# Altium schematic sheet Schematic sheet.SchDoc
size A4
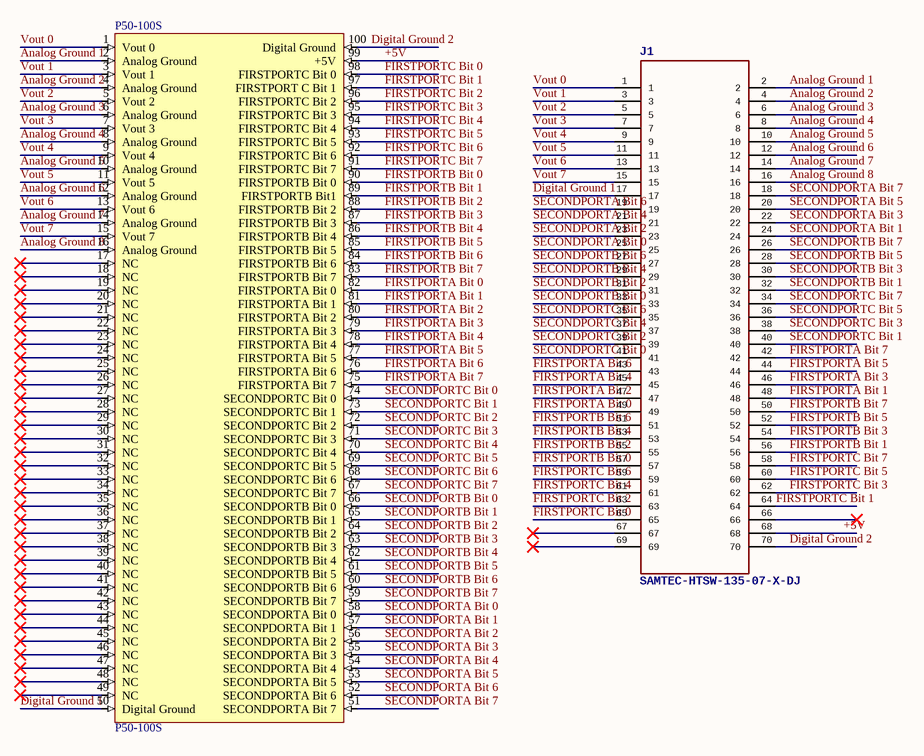
[diagram p0: Schematic sheet.SchDoc]

## Parts
J1  SAMTEC-HTSW-135-07-X-DJ  [SAMTEC-HTSW-135-07-X-D]
P50-100S  P50-100S  [P50-100S-R1-EA]

## Nets
+5V: J1.68 P50-100S.99(+5V)
Analog Ground 1: J1.2 P50-100S.2(Analog_Ground)
Analog Ground 2: J1.4 P50-100S.4(Analog_Ground)
Analog Ground 3: J1.6 P50-100S.6(Analog_Ground)
Analog Ground 4: J1.8 P50-100S.8(Analog_Ground)
Analog Ground 5: J1.10 P50-100S.10(Analog_Ground)
Analog Ground 6: J1.12 P50-100S.12(Analog_Ground)
Analog Ground 7: J1.14 P50-100S.14(Analog_Ground)
Analog Ground 8: J1.16 P50-100S.16(Analog_Ground)
Digital Ground 1: J1.17 P50-100S.50(Digital_Ground)
Digital Ground 2: J1.70 P50-100S.100(Digital_Ground)
FIRSTPORTA Bit 0: J1.49 P50-100S.82(FIRSTPORTA_Bit_0)
FIRSTPORTA Bit 1: J1.48 P50-100S.81(FIRSTPORTA_Bit_1)
FIRSTPORTA Bit 2: J1.47 P50-100S.80(FIRSTPORTA_Bit_2)
FIRSTPORTA Bit 3: J1.46 P50-100S.79(FIRSTPORTA_Bit_3)
FIRSTPORTA Bit 4: J1.45 P50-100S.78(FIRSTPORTA_Bit_4)
FIRSTPORTA Bit 5: J1.44 P50-100S.77(FIRSTPORTA_Bit_5)
FIRSTPORTA Bit 6: J1.43 P50-100S.76(FIRSTPORTA_Bit_6)
FIRSTPORTA Bit 7: J1.42 P50-100S.75(FIRSTPORTA_Bit_7)
FIRSTPORTB Bit 0: J1.57 P50-100S.90(FIRSTPORTB_Bit_0)
FIRSTPORTB Bit 1: J1.56 P50-100S.89(FIRSTPORTB_Bit1)
FIRSTPORTB Bit 2: J1.55 P50-100S.88(FIRSTPORTB_Bit_2)
FIRSTPORTB Bit 3: J1.54 P50-100S.87(FIRSTPORTB_Bit_3)
FIRSTPORTB Bit 4: J1.53 P50-100S.86(FIRSTPORTB_Bit_4)
FIRSTPORTB Bit 5: J1.52 P50-100S.85(FIRSTPORTB_Bit_5)
FIRSTPORTB Bit 6: J1.51 P50-100S.84(FIRSTPORTB_Bit_6)
FIRSTPORTB Bit 7: J1.50 P50-100S.83(FIRSTPORTB_Bit_7)
FIRSTPORTC Bit 0: J1.65 P50-100S.98(FIRSTPORTC_Bit_0)
FIRSTPORTC Bit 1: J1.64 P50-100S.97(FIRSTPORT_C_Bit_1)
FIRSTPORTC Bit 2: J1.63 P50-100S.96(FIRSTPORTC_Bit_2)
FIRSTPORTC Bit 3: J1.62 P50-100S.95(FIRSTPORTC_Bit_3)
FIRSTPORTC Bit 4: J1.61 P50-100S.94(FIRSTPORTC_Bit_4)
FIRSTPORTC Bit 5: J1.60 P50-100S.93(FIRSTPORTC_Bit_5)
FIRSTPORTC Bit 6: J1.59 P50-100S.92(FIRSTPORTC_Bit_6)
FIRSTPORTC Bit 7: J1.58 P50-100S.91(FIRSTPORTC_Bit_7)
SECONDPORTA Bit 0: J1.25 P50-100S.58(SECONDPORTA_Bit_0)
SECONDPORTA Bit 1: J1.24 P50-100S.57(SECONPDORTA_Bit_1)
SECONDPORTA Bit 2: J1.23 P50-100S.56(SECONDPORTA_Bit_2)
SECONDPORTA Bit 3: J1.22 P50-100S.55(SECONDPORTA_Bit_3)
SECONDPORTA Bit 4: J1.21 P50-100S.54(SECONDPORTA_Bit_4)
SECONDPORTA Bit 5: J1.20 P50-100S.53(SECONDPORTA_Bit_5)
SECONDPORTA Bit 6: J1.19 P50-100S.52(SECONDPORTA_Bit_6)
SECONDPORTA Bit 7: J1.18 P50-100S.51(SECONDPORTA_Bit_7)
SECONDPORTB Bit 0: J1.33 P50-100S.66(SECONDPORTB_Bit_0)
SECONDPORTB Bit 1: J1.32 P50-100S.65(SECONDPORTB_Bit_1)
SECONDPORTB Bit 2: J1.31 P50-100S.64(SECONDPORTB_Bit_2)
SECONDPORTB Bit 3: J1.30 P50-100S.63(SECONDPORTB_Bit_3)
SECONDPORTB Bit 4: J1.29 P50-100S.62(SECONDPORTB_Bit_4)
SECONDPORTB Bit 5: J1.28 P50-100S.61(SECONDPORTB_Bit_5)
SECONDPORTB Bit 6: J1.27 P50-100S.60(SECONDPORTB_Bit_6)
SECONDPORTB Bit 7: J1.26 P50-100S.59(SECONDPORTB_Bit_7)
SECONDPORTC Bit 0: J1.41 P50-100S.74(SECONDPORTC_Bit_0)
SECONDPORTC Bit 1: J1.40 P50-100S.73(SECONDPORTC_Bit_1)
SECONDPORTC Bit 2: J1.39 P50-100S.72(SECONDPORTC_Bit_2)
SECONDPORTC Bit 3: J1.38 P50-100S.71(SECONDPORTC_Bit_3)
SECONDPORTC Bit 4: J1.37 P50-100S.70(SECONDPORTC_Bit_4)
SECONDPORTC Bit 5: J1.36 P50-100S.69(SECONDPORTC_Bit_5)
SECONDPORTC Bit 6: J1.35 P50-100S.68(SECONDPORTC_Bit_6)
SECONDPORTC Bit 7: J1.34 P50-100S.67(SECONDPORTC_Bit_7)
Vout 0: J1.1 P50-100S.1(Vout_0)
Vout 1: J1.3 P50-100S.3(Vout_1)
Vout 2: J1.5 P50-100S.5(Vout_2)
Vout 3: J1.7 P50-100S.7(Vout_3)
Vout 4: J1.9 P50-100S.9(Vout_4)
Vout 5: J1.11 P50-100S.11(Vout_5)
Vout 6: J1.13 P50-100S.13(Vout_6)
Vout 7: J1.15 P50-100S.15(Vout_7)

Not connected (* = marked no-connect by the designer): J1 66* 67* 69*; P50-100S 17(NC)* 18(NC)* 19(NC)* 20(NC)* 21(NC)* 22(NC)* 23(NC)* 24(NC)* 25(NC)* 26(NC)* 27(NC)* 28(NC)* 29(NC)* 30(NC)* 31(NC)* 32(NC)* 33(NC)* 34(NC)* 35(NC)* 36(NC)* 37(NC)* 38(NC)* 39(NC)* 40(NC)* 41(NC)* 42(NC)* 43(NC)* 44(NC)* 45(NC)* 46(NC)* 47(NC)* 48(NC)* 49(NC)*